# Altium schematic sheet 2_ESP_batt_shield-MCU_and_sensors.SchDoc
size A4; SheetNumber: 3; SheetTotal: 3
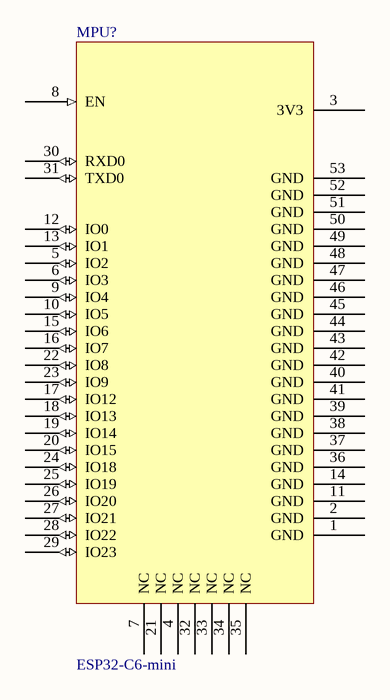
[diagram p0: 2_ESP_batt_shield-MCU_and_sensors.SchDoc]

## Parts
MPU?  ESP32-C6-mini  [ESP32C6_MINI]

## Nets

Not connected (* = marked no-connect by the designer): MPU? 1(GND) 2(GND) 3(3V3) 4(NC) 5(IO2) 6(IO3) 7(NC) 8(EN) 9(IO4) 10(IO5) 11(GND) 12(IO0) 13(IO1) 14(GND) 15(IO6) 16(IO7) 17(IO12) 18(IO13) 19(IO14) 20(IO15) 21(NC) 22(IO8) 23(IO9) 24(IO18) 25(IO19) 26(IO20) 27(IO21) 28(IO22) 29(IO23) 30(RXD0) 31(TXD0) 32(NC) 33(NC) 34(NC) 35(NC) 36(GND) 37(GND) 38(GND) 39(GND) 40(GND) 41(GND) 42(GND) 43(GND) 44(GND) 45(GND) 46(GND) 47(GND) 48(GND) 49(GND) 50(GND) 51(GND) 52(GND) 53(GND)